# Altium schematic sheet Schematic.SchDoc
size A3; SheetNumber: 1; SheetTotal: 1
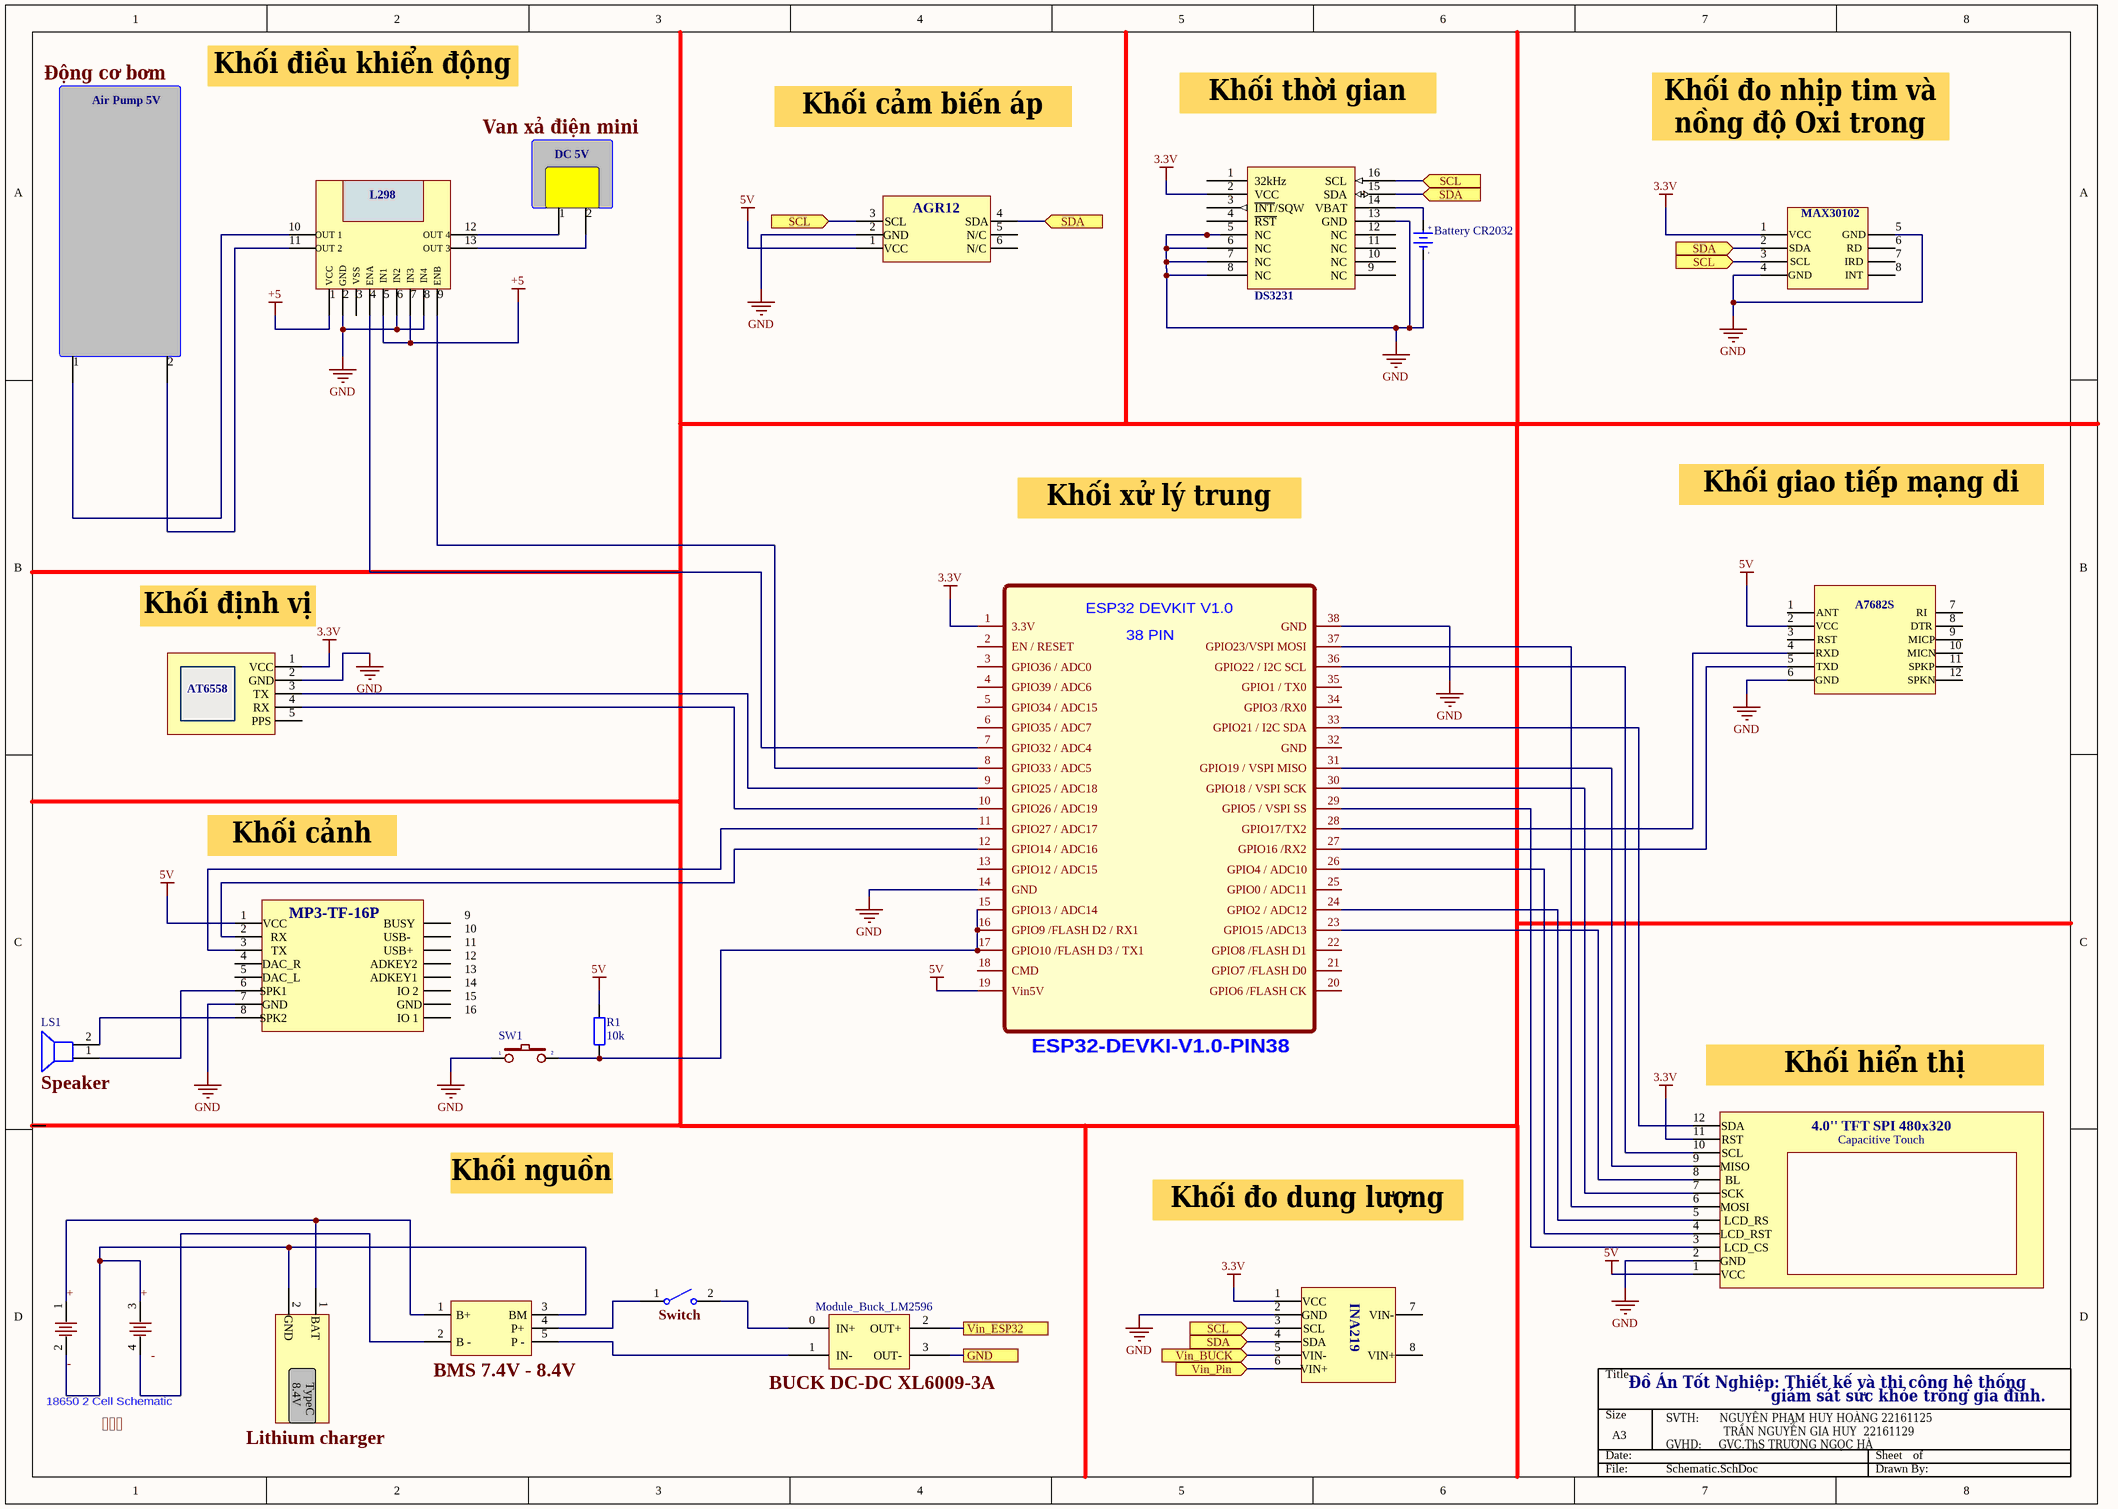
[diagram p0: Schematic.SchDoc]

## Parts
(Parts that share a designator on the sheet are numbered #1, #2 ... from top to bottom, then left to right.)
?#1  (no value)  [SL3016]
?#2  Battery CR2032  [PIN3V]
?#3  ESP32-DEVKI-V1.0-PIN38  [ESP32-DEVKIT-V1.0-38PIN]
?#4  Single-Pole, Single-Throw Switch  (value not drawn)
?#5  18650 2 Cell Schematic  [18650 2 CELL HOLDER LIB]
LS1  Speaker  [SPEAKER]
Module_Buck_LM2596  BUCK DC-DC XL6009-3A  [module_buck_LM2596]
R1  10k  [R1/4W]
SW1  (no value)  [SW2]

## Ports
GND, SCL (in, see Schematic[2A], Schematic[5A], Schematic[5D], Schematic[6B], Schematic[7C]), SCL (in, see Schematic[2A], Schematic[5A], Schematic[6B], Schematic[7A], Schematic[7C]), SCL (in, see Schematic[2A], Schematic[5D], Schematic[6B], Schematic[7A], Schematic[7C]), SCL (in, see Schematic[5A], Schematic[5D], Schematic[6B], Schematic[7A], Schematic[7C]), SDA (in, see Schematic[3A], Schematic[5A], Schematic[5D], Schematic[6B], Schematic[7C]), SDA (in, see Schematic[3A], Schematic[5A], Schematic[6B], Schematic[7A], Schematic[7C]), SDA (in, see Schematic[3A], Schematic[5D], Schematic[6B], Schematic[7A], Schematic[7C]), SDA (in, see Schematic[5A], Schematic[5D], Schematic[6B], Schematic[7A], Schematic[7C]), Vin_BUCK (in), Vin_ESP32, Vin_Pin (in)

## Nets
3.3V: ?#1.2(VCC) ?#3.1(3.3V)
5V: ?#3.19(Vin5V) R1.2
GND: ?#1.5(NC) ?#1.6(NC) ?#1.7(NC) ?#1.8(NC) ?#1.13(GND) ?#2.2(GND) ?#3.14(GND) ?#3.38(GND) SW1.1
+: ?#5.1(BAT1+) ?#5.2(BAT1-) ?#5.3(BAT2+)
GND: Module_Buck_LM2596.3(OUT-) ; port GND  [a separate net that carries the same name]
SCL: ?#1.16(SCL) ; port SCL
SDA: ?#1.15(SDA) ; port SDA
Vin_ESP32: Module_Buck_LM2596.2(OUT+) ; port Vin_ESP32
Net?#1_14: ?#1.14(VBAT) ?#2.1(+3V)
Net?#3_15: ?#3.15(GPIO13_/_ADC14) ?#3.16(GPIO9_/FLASH_D2_/_RX1) ?#3.17(GPIO10_/FLASH_D3_/_TX1) R1.1 SW1.2
Net?#4_2: ?#4.2 Module_Buck_LM2596.0(IN+)

Not connected (* = marked no-connect by the designer): ?#1 1(32kHz) 3(~{INT}/SQW) 4(~{RST}) 9(NC) 10(NC) 11(NC) 12(NC); ?#3 2(EN_/_RESET) 3(GPIO36_/_ADC0) 4(GPIO39_/_ADC6) 5(GPIO34_/_ADC15) 6(GPIO35_/_ADC7) 7(GPIO32_/_ADC4) 8(GPIO33_/_ADC5) 9(GPIO25_/_ADC18) 10(GPIO26_/_ADC19) 11(GPIO27_/_ADC17) 12(GPIO14_/_ADC16) 13(GPIO12_/_ADC15) 18(CMD) 20(GPIO6_/FLASH_CK) 21(GPIO7_/FLASH_D0) 22(GPIO8_/FLASH_D1) 23(GPIO15_/ADC13) 24(GPIO2_/_ADC12) 25(GPIO0_/_ADC11) 26(GPIO4_/_ADC10) 27(GPIO16_/RX2) 28(GPIO17/TX2) 29(GPIO5_/_VSPI_SS) 30(GPIO18_/_VSPI_SCK) 31(GPIO19_/_VSPI_MISO) 32(GND) 33(GPIO21_/_I2C_SDA) 34(GPIO3_/RX0) 35(GPIO1_/_TX0) 36(GPIO22_/_I2C_SCL) 37(GPIO23/VSPI_MOSI); ?#4 1; ?#5 4(BAT2-); LS1 1 2; Module_Buck_LM2596 1(IN-)

## Notes on the sheet
- Air Pump 5V
- Động cơ bơm
- Khối điều khiển động cơ
- Khối thời gian thực
- DC 5V
- Van xả điện mini
- Khối cảm biến áp suất
- Khối đo nhịp tim và nồng độ Oxi trong máu
- 10
- 11
- OUT 1
- OUT 2
- L298
- OUT 4
- OUT 3
- 12
- 13
- 1
- 2
- 3
- VCC
- GND
- SCL
- AGR12
- SDA
- N/C
- 4
- 5
- 6
- MAX30102
- RD
- VSS
- ENA
- IN1
- IN2
- IN3
- 7
- IN4
- 8
- ENB
- 9
- DS3231
- IRD
- INT
- Khối xử lý trung tâm
- Khối giao tiếp mạng di động
- Khối định vị
- ANT
- RST
- RXD
- A7682S
- RI
- DTR
- MICP
- MICN
- AT6558
- RX
- TX
- PPS
- TXD
- SPKP
- SPKN
- Khối cảnh báo
- MP3-TF-16P
- BUSY
- DAC_L
- DAC_R
- SPK1
- ADKEY2
- ADKEY1
- USB-
- USB+
- IO 2
- 14
- SPK2
- IO 1
- 15
- (near SW1) 16
- Khối hiển thị
- 4.0'' TFT SPI 480x320
- Khối nguồn
- MISO
- BL
- SCK
- Capacitive Touch
- Khối đo dung lượng pin
- MOSI
- LCD_RS
- LCD_RST
- LCD_CS
- BAT
- B+
- BM
- P+
- Switch
- INA219
- VIN-
- 8.4V
- TypeC
- B -
- BMS 7.4V - 8.4V
- P -
- VIN+
- Đồ Án Tốt Nghiệp: Thiết kế và thi công hệ thống
- giám sát sức khỏe trong gia đình.
- 
- Lithium charger
- SVTH:      NGUYỄN PHẠM HUY HOÀNG	22161125
  TRẦN NGUYỄN GIA HUY		22161129
  GVHD:     GVC.ThS TRƯƠNG NGỌC HÀ
- Labels drawn without touching a wire or pin: 1, 2, -
- (in symbol ESP32-DEVKI-V1.0-PIN38) ESP32 DEVKIT V1.0; 38 PIN
- (in symbol PIN 3V) +; -

## Library data of the parts
?#1 = DS3231
?#2 = PIN 3V: Battery 3VDC; Value: PIN 3V
?#4 = SPST SW: closed: 0; Rclosed: 1m; Ropen: 1Meg; SimulationGenericComponent: True
?#5 = 18650 2 Cell Schematic Lib
LS1 = Speaker: Loudspeaker; Published: 24-Mar-1999; LatestRevisionDate: 17-Jul-2002; LatestRevisionNote: Re-released for DXP Platform.; PackageReference: PIN2; Publisher: Altium Limited
Module_Buck_LM2596 = Module_buck_LM2596: module buck DC - DC LM2596
R1 = R1/4W: Resistor 1/4W; Value: R1/4W - 1K
SW1 = SW2: Switch button 2 pin; Value: SW chip 2 pin